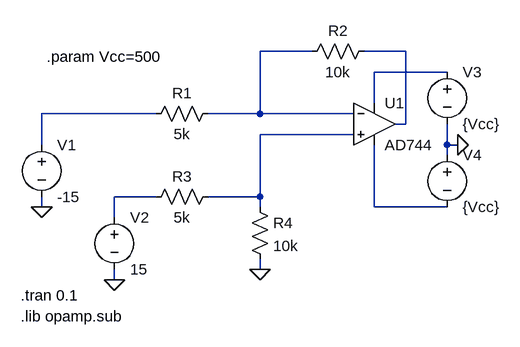
[diagram p0: schematic Draft7.asc]
Draft7.asc, the LTspice schematic file:
Version 4.1
SHEET 1 880 680
WIRE 304 0 224 0
WIRE 448 0 384 0
WIRE 512 32 400 32
WIRE 400 80 400 32
WIRE 64 96 -112 96
WIRE 224 96 224 0
WIRE 224 96 144 96
WIRE 368 96 224 96
WIRE 448 112 448 0
WIRE 448 112 432 112
WIRE 368 128 224 128
WIRE -112 144 -112 96
WIRE 512 144 512 112
WIRE 528 144 512 144
WIRE 512 160 512 144
WIRE 64 224 0 224
WIRE 224 224 224 128
WIRE 224 224 144 224
WIRE -112 240 -112 224
WIRE 224 240 224 224
WIRE 400 240 400 144
WIRE 512 240 400 240
WIRE 0 256 0 224
WIRE 224 336 224 320
WIRE 0 352 0 336
FLAG -112 240 0
FLAG 224 336 0
FLAG 0 352 0
FLAG 528 144 0
SYMBOL res 400 -16 R90
WINDOW 0 0 56 VBottom 2
WINDOW 3 32 56 VTop 2
SYMATTR InstName R2
SYMATTR Value 10k
SYMBOL res 160 80 R90
WINDOW 0 0 56 VBottom 2
WINDOW 3 32 56 VTop 2
SYMATTR InstName R1
SYMATTR Value 5k
SYMBOL voltage -112 128 R0
SYMATTR InstName V1
SYMATTR Value -15
SYMBOL res 208 224 R0
SYMATTR InstName R4
SYMATTR Value 10k
SYMBOL res 160 208 R90
WINDOW 0 0 56 VBottom 2
WINDOW 3 32 56 VTop 2
SYMATTR InstName R3
SYMATTR Value 5k
SYMBOL voltage 0 240 R0
WINDOW 123 0 0 Left 0
WINDOW 39 0 0 Left 0
SYMATTR InstName V2
SYMATTR Value 15
SYMBOL OpAmps\\AD744 400 48 R0
SYMATTR InstName U1
SYMBOL voltage 512 144 R0
SYMATTR InstName V4
SYMATTR Value {Vcc}
SYMBOL voltage 512 16 R0
SYMATTR InstName V3
SYMATTR Value {Vcc}
TEXT -144 376 Left 2 !.tran 0.1
TEXT -144 408 Left 2 !.lib opamp.sub
TEXT -104 8 Left 2 !.param Vcc=500

The netlist it stands for:
* Draft7.asc
R2 N002 N001 10k
R1 N001 N004 5k
V1 N004 0 -15
R4 N005 0 10k
R3 N005 N006 5k
V2 N006 0 15
X§U1 N005 N001 N003 N007 N002 AD744  ; pins In+ In- V+ V- OUT
V4 0 N007 {Vcc}
V3 N003 0 {Vcc}
.tran 0.1
.lib opamp.sub
.param Vcc=500
.backanno
.end